# Altium schematic sheet SCH Pg2 Cell Bank.SchDoc: CZAR Power - Li-Ion Batt Brd BOT
size Letter; Organization: Adv Power Electronics Lab; Address1: Kettering University; Address2: 1700 University Ave; Address3: Flint, MI 48504; Address4: United States of America; DocumentNumber: 2; SheetNumber: 2; SheetTotal: 7
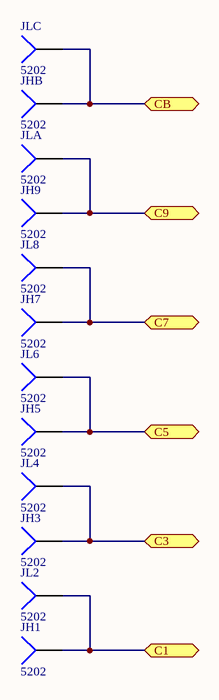
[diagram p0: SCH Pg2 Cell Bank.SchDoc]

## Parts
JH1  5202  [BAT-KS5202-PTH]
JH3  5202  [BAT-KS5202-PTH]
JH5  5202  [BAT-KS5202-PTH]
JH7  5202  [BAT-KS5202-PTH]
JH9  5202  [BAT-KS5202-PTH]
JHB  5202  [BAT-KS5202-PTH]
JL2  5202  [BAT-KS5202-PTH]
JL4  5202  [BAT-KS5202-PTH]
JL6  5202  [BAT-KS5202-PTH]
JL8  5202  [BAT-KS5202-PTH]
JLA  5202  [BAT-KS5202-PTH]
JLC  5202  [BAT-KS5202-PTH]

## Ports
C1, C3, C5, C7, C9, CB

## Nets
C1: JH1.1 JL2.1 ; port C1
C3: JH3.1 JL4.1 ; port C3
C5: JH5.1 JL6.1 ; port C5
C7: JH7.1 JL8.1 ; port C7
C9: JH9.1 JLA.1 ; port C9
CB: JHB.1 JLC.1 ; port CB

## Notes on the sheet
- Title
- Size:
- Date:
- Letter
- Number:
- Time:
- Revision:
- Sheet
- of
- File:

## Library data of the parts
JH1 JH3 JH5 JH7 JH9 JHB JL2 JL4 JL6 JL8 JLA JLC = KS5202: Hardware, Battery Contact Spring, PCB-mount; Category: J; Supplier 1: Digi-Key; Supplier Part Number 1: 36-5202-ND